# Altium project HoloCubicV01_211230.PrjPCB
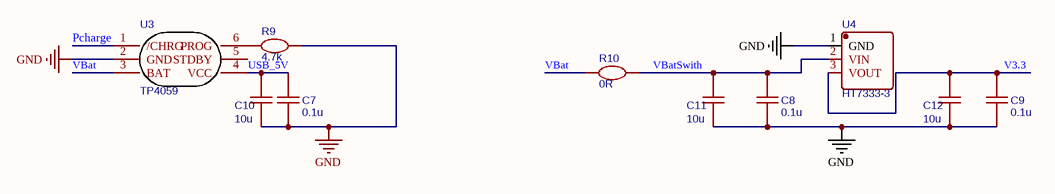
[diagram p0: HoloCubicPower_211230.SchDoc]
4 sheets, 31 parts. Net scope: global (net labels, ports and power ports of the same name join across sheets).
Board file: HoloCubic_211230.PcbDoc
Sheets:
  HoloCubicPower_211230.SchDoc
  HoloCubicCh340n_211230.SchDoc
  HoloCubicConnect_211230.SchDoc
  HoloCubicMCU_211230.SchDoc

## Sheet HoloCubicPower_211230.SchDoc
size A4

### Parts
C7  0.1u  [C0603]
C8  0.1u  [C0603]
C9  0.1u  [C0603]
C10  10u  [C0603]
C11  10u  [C0603]
C12  10u  [C0603]
R9  4.7k  [R0603]
R10  0R  [R0805]
U3  TP4059  [SOT-23-6]
U4  HT7333-3  [SOT-89]

### Nets
GND: C7.1 C8.1 C9.1 C10.1 C11.1 C12.1 R9.1 U3.2(GND) U4.1(GND)
Pcharge: U3.1(/CHRG)  [project net IO33]
USB_5V: C7.2 C10.2 U3.4(VCC)
V3.3: C9.2 C12.2 U4.3(VOUT)
VBat: R10.2 U3.3(BAT)
VBatSwith: C8.2 C11.2 R10.1 U4.2(VIN)
NetR9_2: R9.2 U3.6(PROG)

Not connected (* = marked no-connect by the designer): U3 5(STDBY)

### Library data of the parts
C7-C12 = 0.1u: nameAlias: Value(F); Contributor: LCEDA_Lib; spicePre: C; spiceSymbolName: C_0603_US
R9 R10 = 10k: Contributor: LCEDA_Lib; spicePre: R; spiceSymbolName: R_0603_EU
U3 = TP4059: BOM_Manufacturer: TOPPOWER; BOM_Supplier: LCSC; BOM_Manufacturer Part: TP4059; BOM_Supplier Part: C80364; BOM_JLCPCB Part Class: Extended Part; spicePre: U; spiceSymbolName: TP4059
U4 = HT7333-3: BOM_Manufacturer: HOLTEK; BOM_Supplier: LCSC; BOM_Manufacturer Part: HT7333-3; BOM_Supplier Part: C84207; BOM_JLCPCB Part Class: Extended Part; spicePre: U; spiceSymbolName: HT7333-3

## Sheet HoloCubicCh340n_211230.SchDoc
size A4
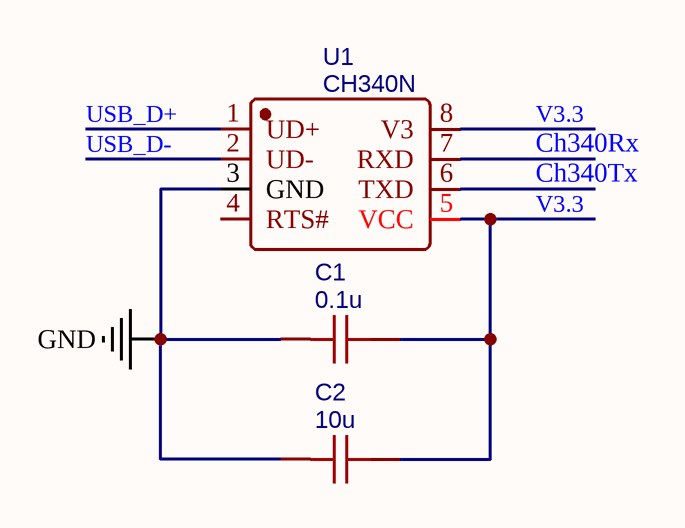
[diagram p1: HoloCubicCh340n_211230.SchDoc]

### Parts
C1  0.1u  [C0603]
C2  10u  [C0603]
U1  CH340N  [SOP-8_L5.0-W4.0-P1.27-LS6.0-BL]

### Nets
GND: C1.2 C2.2 U1.3(GND)
Ch340Rx: U1.7(RXD)
Ch340Tx: U1.6(TXD)
USB_D+: U1.1(UD+)
USB_D-: U1.2(UD-)
V3.3: C1.1 C2.1 U1.5(VCC) U1.8(V3)

Not connected (* = marked no-connect by the designer): U1 4(RTS#)

### Library data of the parts
C1 = 0.1u: as C7 on sheet HoloCubicPower_211230; spicePre: C; spiceSymbolName: C_0603_US
C2 = 10u: nameAlias: Value(F); Contributor: LCEDA_Lib; spicePre: C; spiceSymbolName: C_0603_US
U1 = CH340N: BOM_Manufacturer: WCH(Jiangsu Qin Heng); Contributor: LCSC; BOM_Supplier: LCSC; BOM_Supplier Part: C506813; BOM_Manufacturer Part: CH340N; BOM_JLCPCB Part Class: Extended Part; spicePre: U; spiceSymbolName: CH340N

## Sheet HoloCubicConnect_211230.SchDoc
size A4
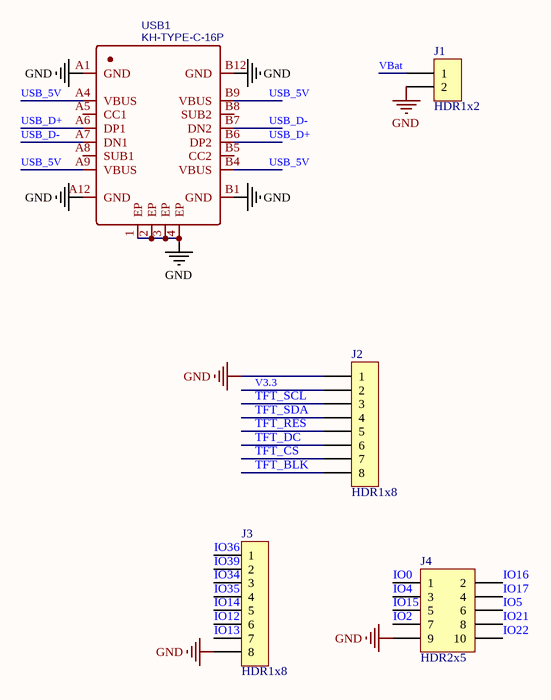
[diagram p2: HoloCubicConnect_211230.SchDoc]

### Parts
J1  HDR1x2  [PIN-2-2.54-1.0]
J2  HDR1x8  [PIN-8-2.54-1.0]
J3  HDR1x8  [PIN-8-2.54-1.0]
J4  HDR2x5  [PIN-2x5-2.54-1.0]
USB1  KH-TYPE-C-16P  [USB-C-SMD_KH-TYPE-C-16P]

### Nets
GND: J1.2 J2.1 J3.8 J4.9 USB1.1(EP) USB1.2(EP) USB1.3(EP) USB1.4(EP) USB1.A1(GND) USB1.A12(GND) USB1.B1(GND) USB1.B12(GND)
IO0: J4.1
IO2: J4.7
IO4: J4.3
IO5: J4.6
IO12: J3.6
IO13: J3.7
IO14: J3.5
IO15: J4.5
IO16: J4.2
IO17: J4.4
IO21: J4.8
IO22: J4.10
IO34: J3.3
IO35: J3.4
IO36: J3.1
IO39: J3.2
TFT_BLK: J2.8  [project net IO19]
TFT_CS: J2.7  [project net IO27]
TFT_DC: J2.6  [project net IO25]
TFT_RES: J2.5  [project net IO26]
TFT_SCL: J2.3  [project net IO18]
TFT_SDA: J2.4  [project net IO23]
USB_5V: USB1.A4(VBUS) USB1.A9(VBUS) USB1.B4(VBUS) USB1.B9(VBUS)
USB_D+: USB1.A6(DP1) USB1.B6(DP2)
USB_D-: USB1.A7(DN1) USB1.B7(DN2)
V3.3: J2.2
VBat: J1.1

Not connected (* = marked no-connect by the designer): USB1 A5(CC1) A8(SUB1) B5(CC2) B8(SUB2)

### Library data of the parts
J1 = HDR1x2: Connector
J2 J3 = HDR1x8: Connector
J4 = HDR2x5: Connector
USB1 = KH-TYPE-C-16P: BOM_Manufacturer: Shenzhen Kinghelm Elec; Contributor: LCSC; BOM_Supplier: LCSC; BOM_Supplier Part: C709357; BOM_Manufacturer Part: KH-TYPE-C-16P; BOM_JLCPCB Part Class: Extended Part; spicePre: U; spiceSymbolName: KH-TYPE-C-16P

## Sheet HoloCubicMCU_211230.SchDoc
size A4
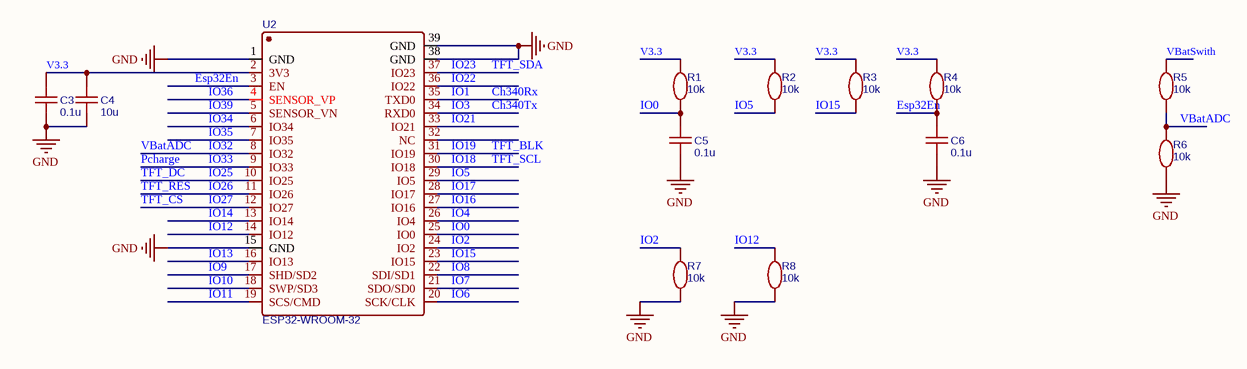
[diagram p3: HoloCubicMCU_211230.SchDoc]

### Parts
C3  0.1u  [C0603]
C4  10u  [C0603]
C5  0.1u  [C0603]
C6  0.1u  [C0603]
R1  10k  [R0603]
R2  10k  [R0603]
R3  10k  [R0603]
R4  10k  [R0603]
R5  10k  [R0603]
R6  10k  [R0603]
R7  10k  [R0603]
R8  10k  [R0603]
U2  ESP32-WROOM-32  [WIFIM-SMD_ESP-32S]

### Nets
GND: C3.1 C4.1 C5.1 C6.1 R6.1 R7.1 R8.1 U2.1(GND) U2.15(GND) U2.38(GND) U2.39(GND)
Ch340Rx: U2.35(TXD0)  [also labelled IO1]
Ch340Tx: U2.34(RXD0)  [also labelled IO3]
Esp32En: C6.2 R4.1 U2.3(EN)
IO0: C5.2 R1.1 U2.25(IO0)
IO2: R7.2 U2.24(IO2)
IO4: U2.26(IO4)
IO5: R2.1 U2.29(IO5)
IO6: U2.20(SCK/CLK)
IO7: U2.21(SDO/SD0)
IO8: U2.22(SDI/SD1)
IO9: U2.17(SHD/SD2)
IO10: U2.18(SWP/SD3)
IO11: U2.19(SCS/CMD)
IO12: R8.2 U2.14(IO12)
IO13: U2.16(IO13)
IO14: U2.13(IO14)
IO15: R3.1 U2.23(IO15)
IO16: U2.27(IO16)
IO17: U2.28(IO17)
IO18: U2.30(IO18)  [also labelled TFT_SCL]
IO19: U2.31(IO19)  [also labelled TFT_BLK]
IO21: U2.33(IO21)
IO22: U2.36(IO22)
IO23: U2.37(IO23)  [also labelled TFT_SDA]
IO25: U2.10(IO25)  [also labelled TFT_DC]
IO26: U2.11(IO26)  [also labelled TFT_RES]
IO27: U2.12(IO27)  [also labelled TFT_CS]
IO32: R5.1 R6.2 U2.8(IO32)  [also labelled VBatADC]
IO33: U2.9(IO33)  [also labelled Pcharge]
IO34: U2.6(IO34)
IO35: U2.7(IO35)
IO36: U2.4(SENSOR_VP)
IO39: U2.5(SENSOR_VN)
V3.3: C3.2 C4.2 R1.2 R2.2 R3.2 R4.2 U2.2(3V3)
VBatSwith: R5.2

Not connected (* = marked no-connect by the designer): U2 32(NC)

### Library data of the parts
C3-C6 = 0.1u: as C7 on sheet HoloCubicPower_211230; spicePre: C; spiceSymbolName: C_0603_US
R1-R8 = 10k: Contributor: LCEDA_Lib; spicePre: R; spiceSymbolName: R_0603_EU
U2 = ESP32-WROOM-32: BOM_Manufacturer: Espressif Systems; Contributor: LCSC; BOM_Supplier: LCSC; BOM_Supplier Part: C82899; BOM_Manufacturer Part: ESP32-WROOM-32; BOM_JLCPCB Part Class: Extended Part; spicePre: U; spiceSymbolName: ESP32-WROOM-32

## Nets that join several sheets
GND: HoloCubicPower_211230 (9 pins), HoloCubicCh340n_211230 (C1.2 C2.2 U1.3), HoloCubicConnect_211230 (12 pins), HoloCubicMCU_211230 (11 pins)
Ch340Rx: HoloCubicCh340n_211230 (U1.7), HoloCubicMCU_211230 (U2.35)
Ch340Tx: HoloCubicCh340n_211230 (U1.6), HoloCubicMCU_211230 (U2.34)
IO0: HoloCubicConnect_211230 (J4.1), HoloCubicMCU_211230 (C5.2 R1.1 U2.25)
IO2: HoloCubicConnect_211230 (J4.7), HoloCubicMCU_211230 (R7.2 U2.24)
IO4: HoloCubicConnect_211230 (J4.3), HoloCubicMCU_211230 (U2.26)
IO5: HoloCubicConnect_211230 (J4.6), HoloCubicMCU_211230 (R2.1 U2.29)
IO12: HoloCubicConnect_211230 (J3.6), HoloCubicMCU_211230 (R8.2 U2.14)
IO13: HoloCubicConnect_211230 (J3.7), HoloCubicMCU_211230 (U2.16)
IO14: HoloCubicConnect_211230 (J3.5), HoloCubicMCU_211230 (U2.13)
IO15: HoloCubicConnect_211230 (J4.5), HoloCubicMCU_211230 (R3.1 U2.23)
IO16: HoloCubicConnect_211230 (J4.2), HoloCubicMCU_211230 (U2.27)
IO17: HoloCubicConnect_211230 (J4.4), HoloCubicMCU_211230 (U2.28)
IO18: HoloCubicConnect_211230 (J2.3), HoloCubicMCU_211230 (U2.30)
IO19: HoloCubicConnect_211230 (J2.8), HoloCubicMCU_211230 (U2.31)
IO21: HoloCubicConnect_211230 (J4.8), HoloCubicMCU_211230 (U2.33)
IO22: HoloCubicConnect_211230 (J4.10), HoloCubicMCU_211230 (U2.36)
IO23: HoloCubicConnect_211230 (J2.4), HoloCubicMCU_211230 (U2.37)
IO25: HoloCubicConnect_211230 (J2.6), HoloCubicMCU_211230 (U2.10)
IO26: HoloCubicConnect_211230 (J2.5), HoloCubicMCU_211230 (U2.11)
IO27: HoloCubicConnect_211230 (J2.7), HoloCubicMCU_211230 (U2.12)
IO33: HoloCubicPower_211230 (U3.1), HoloCubicMCU_211230 (U2.9)
IO34: HoloCubicConnect_211230 (J3.3), HoloCubicMCU_211230 (U2.6)
IO35: HoloCubicConnect_211230 (J3.4), HoloCubicMCU_211230 (U2.7)
IO36: HoloCubicConnect_211230 (J3.1), HoloCubicMCU_211230 (U2.4)
IO39: HoloCubicConnect_211230 (J3.2), HoloCubicMCU_211230 (U2.5)
USB_5V: HoloCubicPower_211230 (C7.2 C10.2 U3.4), HoloCubicConnect_211230 (USB1.A4 USB1.A9 USB1.B4 USB1.B9)
USB_D+: HoloCubicCh340n_211230 (U1.1), HoloCubicConnect_211230 (USB1.A6 USB1.B6)
USB_D-: HoloCubicCh340n_211230 (U1.2), HoloCubicConnect_211230 (USB1.A7 USB1.B7)
V3.3: HoloCubicPower_211230 (C9.2 C12.2 U4.3), HoloCubicCh340n_211230 (C1.1 C2.1 U1.5 U1.8), HoloCubicConnect_211230 (J2.2), HoloCubicMCU_211230 (7 pins)
VBat: HoloCubicPower_211230 (R10.2 U3.3), HoloCubicConnect_211230 (J1.1)
VBatSwith: HoloCubicPower_211230 (C8.2 C11.2 R10.1 U4.2), HoloCubicMCU_211230 (R5.2)